# EAGLE design us8 (EAGLE 6.6.0)
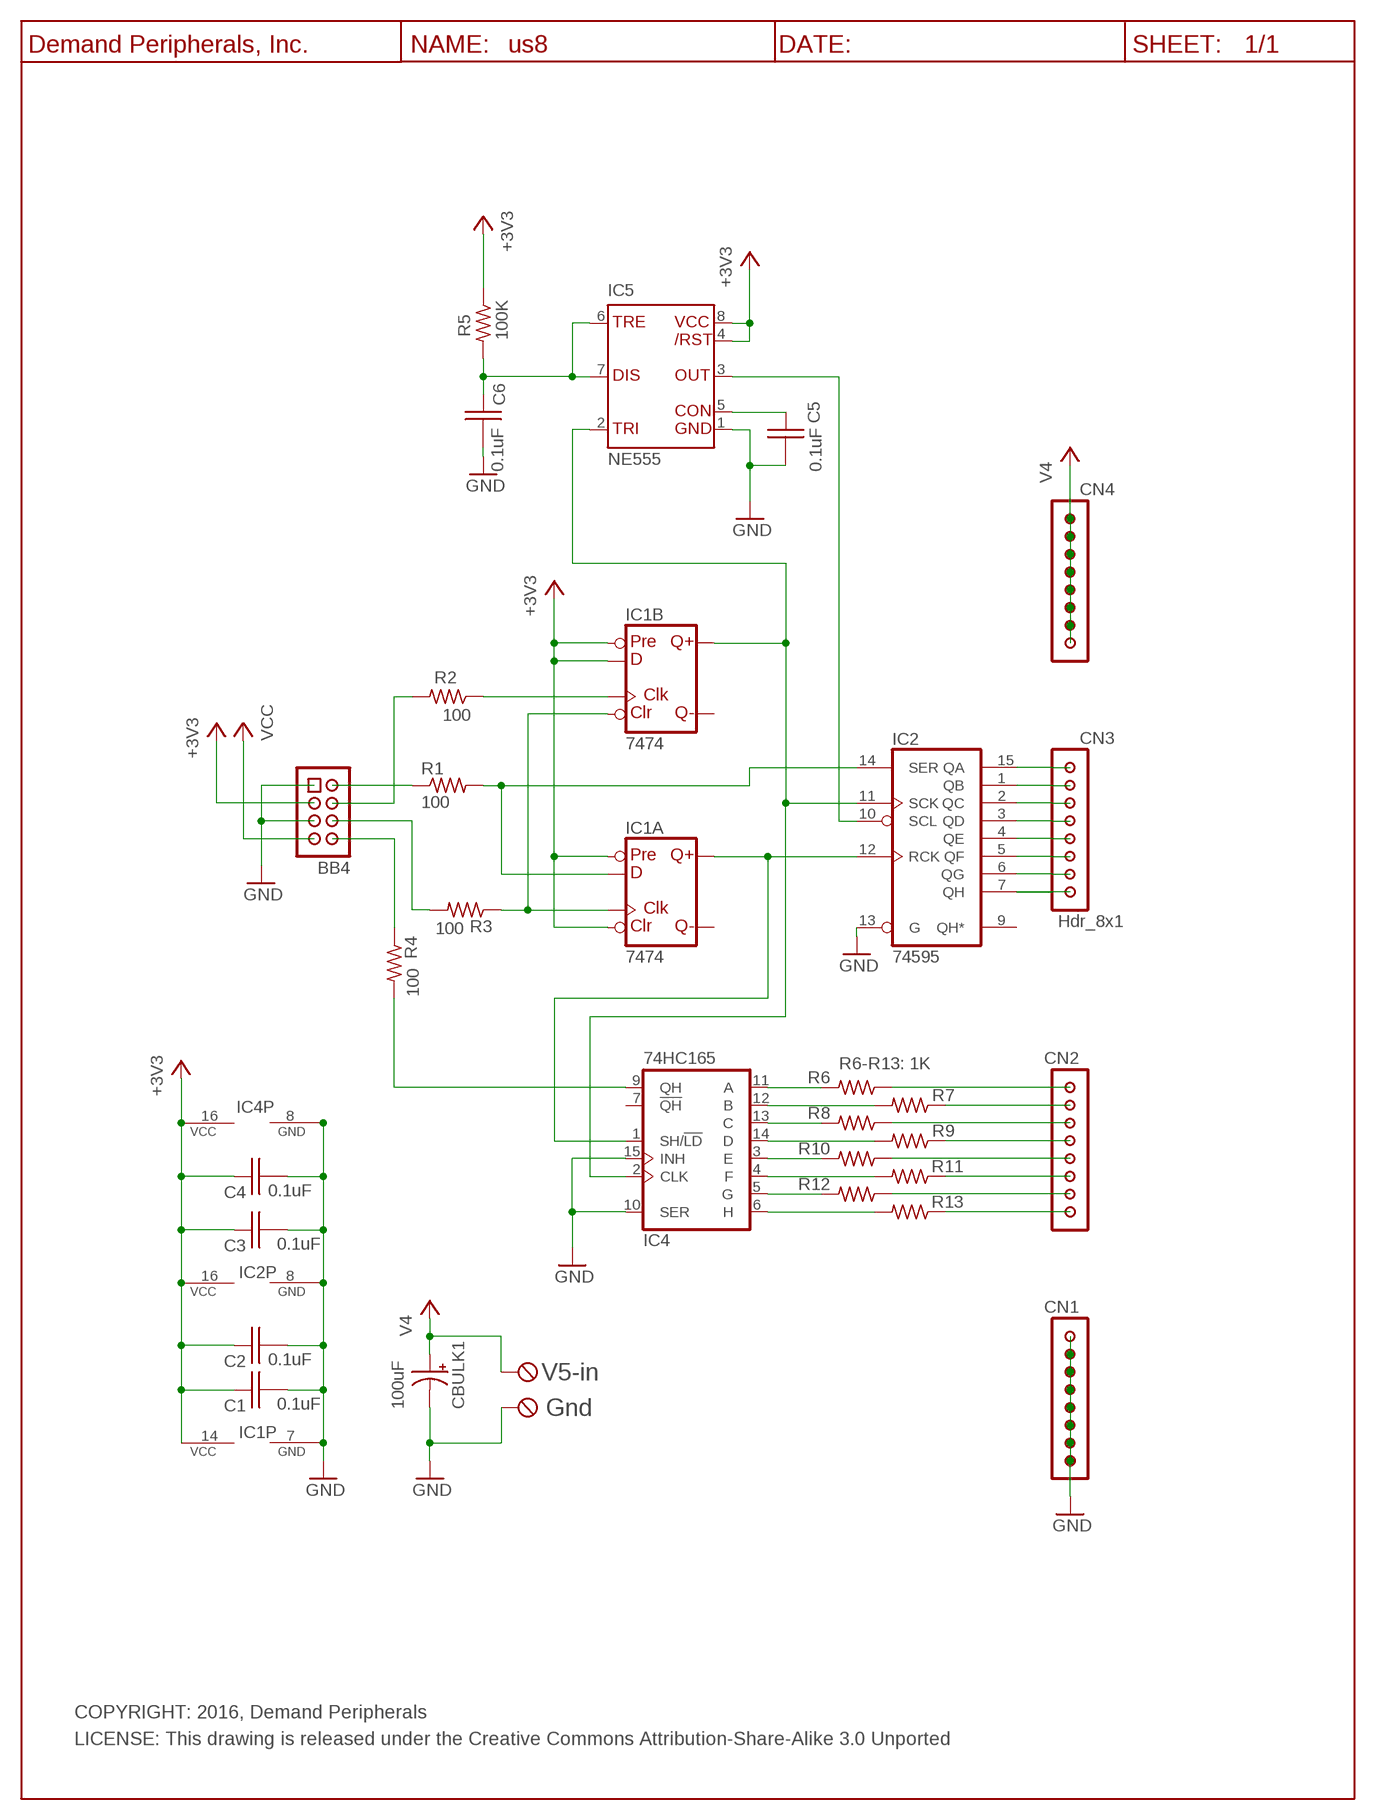
[diagram p0: schematic, sheet 1]

## Parts
BB4  Hdr_4x2  HDR-4X2-SHR  [HDR-4X2]
C1  0.1uF  C0.1UF_C0603  [C0603]
C2  0.1uF  C0.1UF_C0603  [C0603]
C3  0.1uF  C0.1UF_C0603  [C0603]
C4  0.1uF  C0.1UF_C0603  [C0603]
C5  0.1uF  C0.1UF_C0603  [C0603]
C6  0.1uF  C0.1UF_C0603  [C0603]
CBULK1  100uF  C100UF_E3.5-8  [E3.5-8]
CN1  Hdr_8x1  HDR-8X1-NOP1  [HDR-8X1-NOP1]
CN2  Hdr_8x1  HDR-8X1-NOP1  [HDR-8X1-NOP1]
CN3  Hdr_8x1  HDR-8X1-NOP1  [HDR-8X1-NOP1]
CN4  Hdr_8x1  HDR-8X1-NOP1  [HDR-8X1-NOP1]
CN5  TBLK-5.08-X2  [TBLK-5.08-X2]
IC1  7474  74AHC74SS  [SO14]
IC2  74595  [SO16]
IC4  74HC165  [SO16]
IC5  NE555  [SOIC8]
R1  100  R100_R0603  [R0603]
R2  100  R100_R0603  [R0603]
R3  100  R100_R0603  [R0603]
R4  100  R100_R0603  [R0603]
R5  100K  R100K_R0603  [R0603]
R6  1K  R1K_R0603  [R0603]
R7  1K  R1K_R0603  [R0603]
R8  1K  R1K_R0603  [R0603]
R9  1K  R1K_R0603  [R0603]
R10  1K  R1K_R0603  [R0603]
R11  1K  R1K_R0603  [R0603]
R12  1K  R1K_R0603  [R0603]
R13  1K  R1K_R0603  [R0603]
U$4  DP_FRAME_P  [P_FRAME]

## Nets
+3V3: BB4.3 C1.1 C2.1 C3.1 C4.1 IC1.1(A:CLR) IC1.4(A:PRE) IC1.10(B:PRE) IC1.12(B:D) IC1.14(P:VCC) IC2.16(VCC) IC4.16(VCC) IC5.4(/RES) IC5.8(VCC+) R5.1
GND: BB4.1 BB4.5 C1.2 C2.2 C3.2 C4.2 C5.2 C6.2 CBULK1.- CN1.1 CN1.2 CN1.3 CN1.4 CN1.5 CN1.6 CN1.7 CN1.8 CN5.1(KL) IC1.7(P:GND) IC2.8(GND) IC2.13(G) IC4.8(GND) IC4.10(SER) IC4.15(INH) IC5.1(GND)
N$1: BB4.2 R1.1
N$2: BB4.8 R4.1
N$3: CN2.1 R13.1
N$4: CN2.2 R12.1
N$5: CN2.3 R11.1
N$6: IC1.2(A:D) IC2.14(SER) R1.2
N$7: CN2.4 R10.1
N$8: CN2.5 R9.1
N$9: CN2.6 R8.1
N$10: CN2.7 R7.1
N$11: CN2.8 R6.1
N$12: IC4.11(A) R6.2
N$13: IC4.13(C) R8.2
N$14: CN3.1 IC2.7(QH)
N$15: IC1.3(A:CLK) IC1.13(B:CLR) R3.1
N$16: IC1.9(B:Q) IC2.11(SCK) IC4.2(CLK) IC5.2(TRI)
N$17: BB4.4 R2.2
N$18: IC1.11(B:CLK) R2.1
N$19: BB4.6 R3.2
N$20: IC4.9(QH) R4.2
N$21: CN3.2 IC2.6(QG)
N$22: CN3.3 IC2.5(QF)
N$23: CN3.4 IC2.4(QE)
N$24: CN3.5 IC2.3(QD)
N$25: CN3.6 IC2.2(QC)
N$26: CN3.7 IC2.1(QB)
N$27: CN3.8 IC2.15(QA)
N$28: IC4.3(E) R10.2
N$29: IC4.5(G) R12.2
N$30: IC4.12(B) R7.2
N$31: IC4.14(D) R9.2
N$32: IC4.4(F) R11.2
N$33: IC4.6(H) R13.2
N$34: IC1.5(A:Q) IC2.12(RCK) IC4.1(SH/!LD)
N$36: IC2.10(SCL) IC5.3(OUT)
N$37: C6.1 IC5.6(TRE) IC5.7(DIS) R5.2
N$40: C5.1 IC5.5(CON)
V4: CBULK1.+ CN4.1 CN4.2 CN4.3 CN4.4 CN4.5 CN4.6 CN4.7 CN4.8 CN5.2(KL1)
VCC: BB4.7
Unconnected: IC1.6(A:!Q) IC1.8(B:!Q) IC2.9(QH*) IC4.7(!QH)

## Notes on the sheet
- R6-R13: 1K
- V5-in
- Gnd
- COPYRIGHT: 2016, Demand Peripherals
- LICENSE: This drawing is released under the Creative Commons Attribution-Share-Alike 3.0 Unported

## Library data of the parts
BB4 = dpi-conn:HDR-4X2-SHR: Shrouded 4x2 pin header; VENDOR: Digikey; VENDOR-PART-NUM: 609-3530-ND
C1-C6 = dpi-passive:C0.1UF_: 0.1 uF Capacitor, 25V, X7R; VENDOR: Digikey; VENDOR-PART-NUM: 1276-1126-2-ND
CBULK1 = dpi-passive:C100UF_: 100uF polarized capacitor, general purpose; VENDOR: Digikey; VENDOR-PART-NUM: 1572-1044-ND
CN1-CN4 = dpi-conn:HDR-8X1-NOP1: Header, 8x1 with no Pin1 marker; VENDOR: Digikey; VENDOR-PART-NUM: S1012EC-08-ND
CN5 = dpi-conn:TBLK-5.08-X2: Terminal Block, 5.08mm, x2, screw terminals; VENDOR: Digikey; VENDOR-PART-NUM: ED2609-ND
IC1 = dpi-transic:74AHC74: Dual D type positive edge triggered FLIP FLOP, preset and clear; VENDOR: Digikey; VENDOR-PART-NUM: 568-4458-1-ND
IC2 = dpi-transic:74*595: 8-bit SHIFT REGISTER, output latch; VENDOR: Digikey; VENDOR-PART-NUM: 74HC595D(BJ)CT-ND
IC4 = dpi-transic:74HC165: NXP 74HC165 parallel-to-serial shift register; VENDOR: Digikey; VENDOR-PART-NUM: 568-1409-1-ND
IC5 = dpi-transic:NE555: Generic 555 Timer; VENDOR: Digikey; VENDOR-PART-NUM: 296-6502-1-ND
R1-R4 = dpi-passive:R100_: 100 Ohm resistor, 1%, 0.1 watt; VENDOR: Digikey; VENDOR-PART-NUM: 311-100HRTR-ND
R5 = dpi-passive:R100K_: 100K Resistor, 1%, 0.1 watt; VENDOR: Digikey; VENDOR-PART-NUM: 311-100KHRTR-ND
R6-R13 = dpi-passive:R1K_: 1K Resistor, 1%, 0.1 watt; VENDOR: Digikey; VENDOR-PART-NUM: 311-1.00KHRTR-ND
U$4 = dpi-sym:DP_FRAME_P: Portrait/Letter Document Frame

## Board
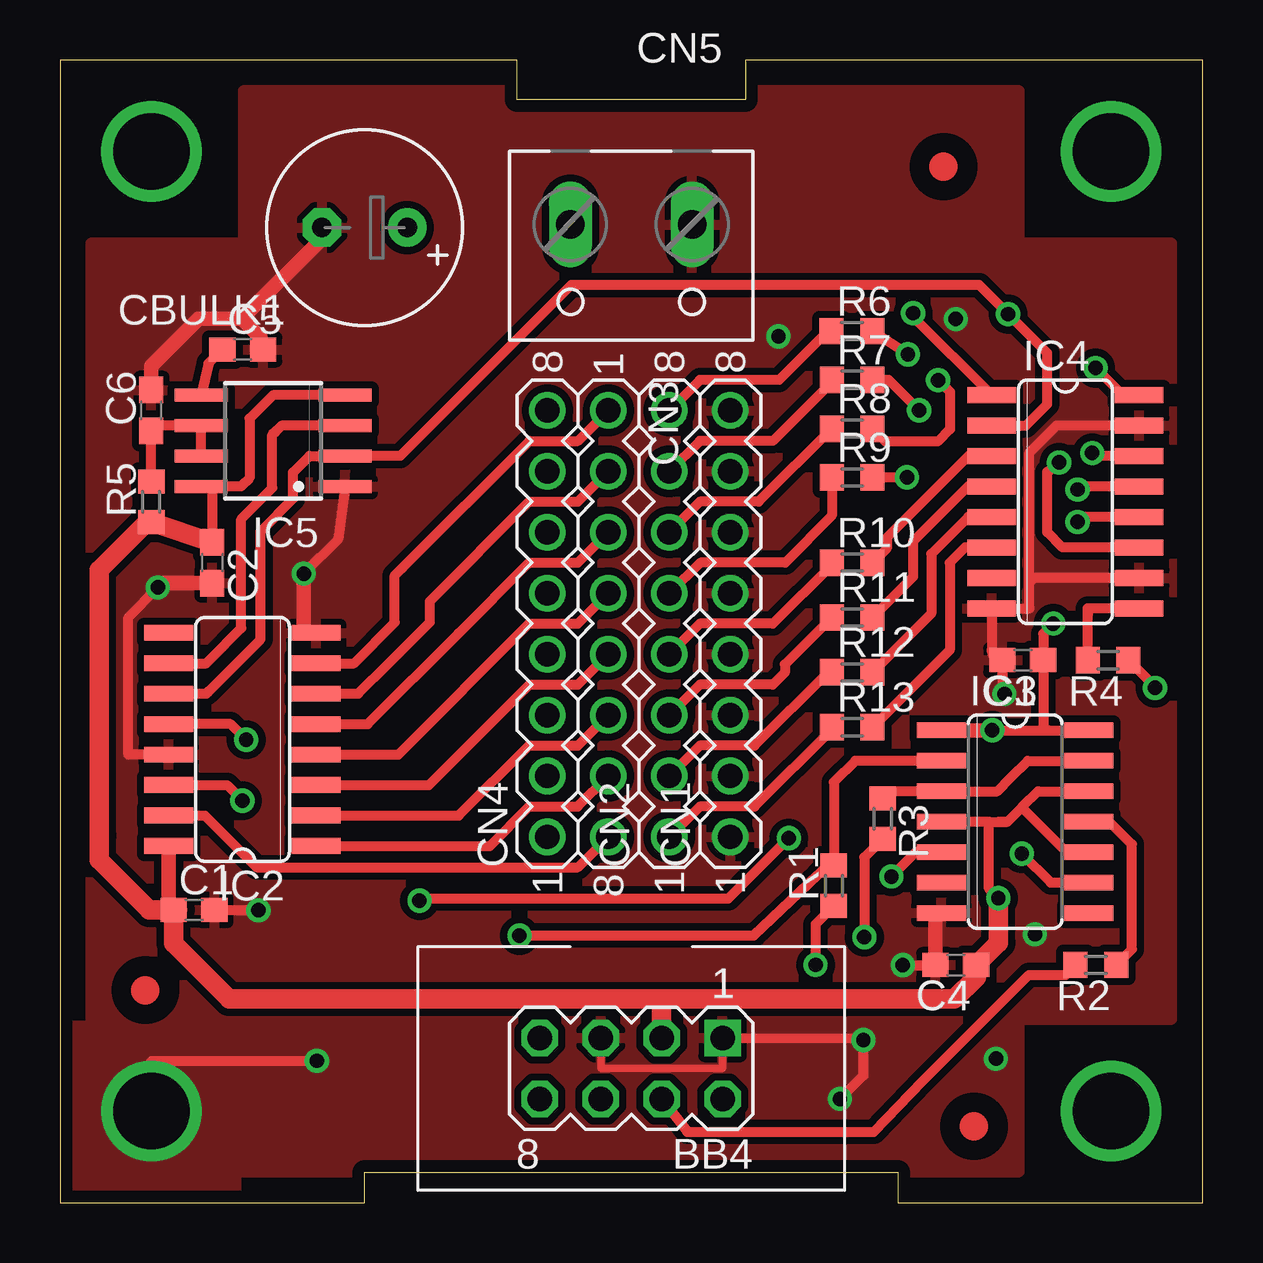
[diagram p1: board, top side]
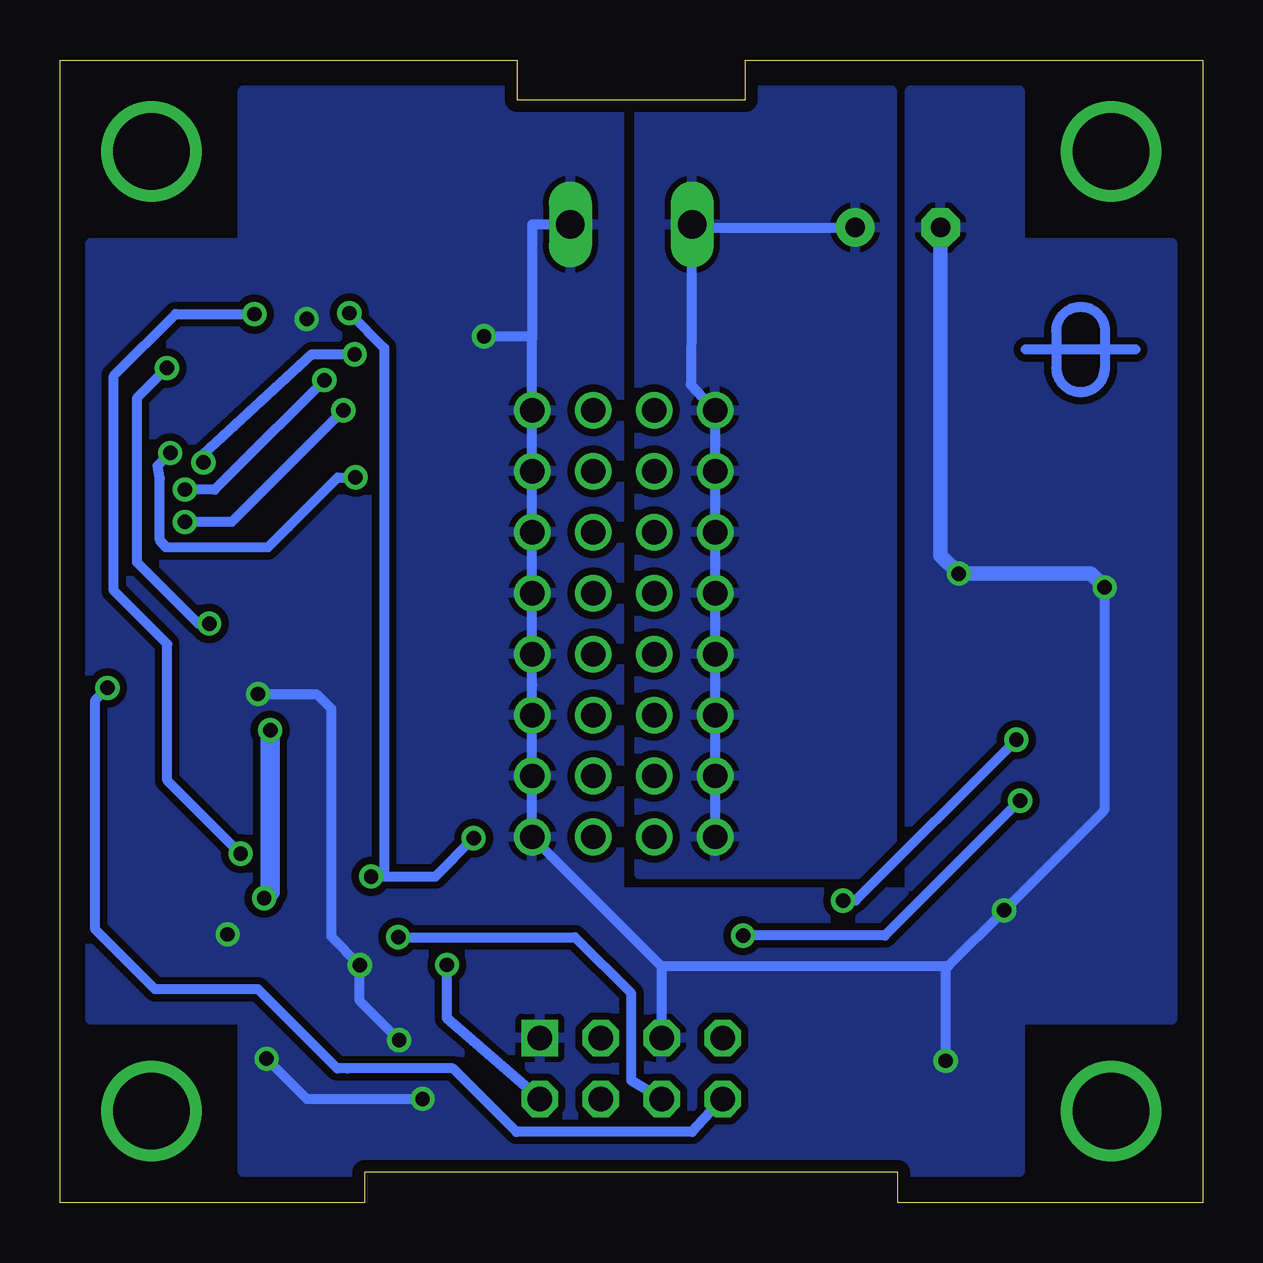
[diagram p2: board, bottom side, seen from below]

Size 47.62 x 47.62 mm. Coordinates in mm from the lower left corner, seen from the top.
Outline: 0,0 12.7,0 12.7,1.27 34.92,1.27 34.92,0 47.62,0 47.62,47.62 28.57,47.62 28.57,45.97 19.05,45.97 19.05,47.62 0,47.62 0,0
Copper layers (1*16): Top 0.035mm / dielectric 1.5mm / Bottom 0.035mm
Design rules "default *": minimum track width 10mil, minimum drill 20mil, track to track 12mil, track to pad 12mil, pad to pad 12mil, via to via 12mil, smd to smd 12mil, copper to edge 20mil, drill to drill 12mil, minimum pad ring 10mil, minimum via ring 8mil, stop-mask expansion 4mil, vias tented up to drill 0mil, thermal gap 10mil
tKeepout: area 15.1,1 to 32.5,9.7; area 15.1,0.5 to 32.5,9.7

### Footprints (pad centres in the part's own frame; a part is rotated, then mirrored left to right if it is on the bottom)
HDR-4X2 = drill 1.016 square: 1 -3.81,-1.27 | drill 1.016 octagon: 2 -3.81,1.27; 3 -1.27,-1.27; 4 -1.27,1.27; 5 1.27,-1.27; 6 1.27,1.27; 7 3.81,-1.27; 8 3.81,1.27
C0603 = smd 1.1 x 1: 1 -0.85,0; 2 0.85,0
E3.5-8 = drill 0.813 pad 1.6: + -1.778,0 | drill 0.813 pad 1.6 octagon: - 1.778,0
HDR-8X1-NOP1 = drill 1.016: 1 -8.89,0; 2 -6.35,0; 3 -3.81,0; 4 -1.27,0; 5 1.27,0; 6 3.81,0; 7 6.35,0; 8 8.89,0
TBLK-5.08-X2 = drill 1.194 long: 1 -2.54,-0.127; 2 2.54,-0.127
SO14 = smd 0.66 x 2.032: 1 -3.81,-3.073; 2 -2.54,-3.073; 3 -1.27,-3.073; 4 0,-3.073; 5 1.27,-3.073; 6 2.54,-3.073; 7 3.81,-3.073; 8 3.81,3.073; 9 2.54,3.073; 10 1.27,3.073; 11 0,3.073; 12 -1.27,3.073; 13 -2.54,3.073; 14 -3.81,3.073
SO16 = smd 0.66 x 2.032: 1 -4.445,-3.073; 2 -3.175,-3.073; 3 -1.905,-3.073; 4 -0.635,-3.073; 5 0.635,-3.073; 6 1.905,-3.073; 7 3.175,-3.073; 8 4.445,-3.073; 9 4.445,3.073; 10 3.175,3.073; 11 1.905,3.073; 12 0.635,3.073; 13 -0.635,3.073; 14 -1.905,3.073; 15 -3.175,3.073; 16 -4.445,3.073
SOIC8 = smd 2.2 x 0.55: 1 -3,1.905; 2 -3,0.635; 3 -3,-0.635; 4 -3,-1.905; 5 3,-1.905; 6 3,-0.635; 7 3,0.635; 8 3,1.905
R0603 = smd 1 x 1.1: 1 -0.85,0; 2 0.85,0

### Placement (x,y rotation side)
BB4  23.81,5.59 180 top
C1  5.59,12.19 0 top
C2  6.35,26.67 270 top
C3  40.13,22.61 180 top
C4  37.34,9.91 180 top
C5  7.62,35.56 0 top
C6  3.81,33.02 90 top
CBULK1  12.7,40.64 180 top
CN1  27.94,24.13 90 top
CN2  25.4,24.13 90 top
CN3  22.86,24.13 270 top
CN4  20.32,24.13 90 top
CN5  23.81,40.64 180 top
IC1  39.81,15.88 270 top
IC2  7.61,19.3 90 top
IC4  41.91,29.21 270 top
IC5  8.89,31.75 180 top
R1  32.26,13.21 90 top
R2  43.18,9.91 180 top
R3  34.29,16 270 top
R4  43.69,22.61 180 top
R5  3.81,29.21 90 top
R6  33.01,36.32 0 top
R7  33.02,34.29 0 top
R8  33.02,32.26 0 top
R9  33.02,30.23 0 top
R10  33.02,26.67 0 top
R11  33.02,24.38 0 top
R12  33.02,22.1 0 top
R13  33.02,19.81 0 top
U$1  [FIDUCIAL]  3.56,8.85 0 top
U$2  [FIDUCIAL]  38.1,3.17 0 top
U$3  [FIDUCIAL]  36.83,43.18 0 top
U$4  -2.54,-2.54 0 top
U$6  [DPI-1]  5.08,35.56 270 bottom

### Tracks (layer width: path | path; a pad name or v marks a point on that pad's centre or on a via)
+3V3  (via drill 0.6)
  Top 0.406: 38.72,15.88 IC1.4 | 38.72,15.88 39.5,15.88 | 39.5,15.88 40.09,16.47 | 40.09,16.47 40.15,16.52 40.77,17.14 IC1.12 | IC1.10 41.95,14.61 40.09,16.47 | 39.5,15.88 39.12,15.88 | v39.12,12.69 38.72,13.08 38.72,15.88 | C2.1 6.35,29.84 IC5.8 7.54,29.84 7.58,29.88 7.9,30.2 7.9,32.68 8.88,33.66 IC5.4 | v38.86,19.68 41.2,19.68 | 41.2,19.68 IC1.14 | 41.2,19.68 40.98,19.68 C3.1 40.98,23.71 v41.4,24.13 | IC4.16 44.3,33.66 v43.17,34.78
  Top 0.61: v38.86,19.68 IC1.1 | C2.1 6.29,27.58 | 5,12.19 C1.1 4.53,12.4 IC2.16
  Top 0.813: v39.12,12.69 39.12,10.83 C4.1 38.19,9.38 37.29,8.48 36.91,8.48 25.02,8.48 | C2.1 R5.1 3.63,28.36 1.64,26.36 1.64,15.29 1.64,14.28 3.72,12.19 C1.1 | C1.1 4.74,10.81 7.06,8.48 25.02,8.48 | C1.1 | BB4.3 25.08,8.42 25.02,8.48
  Bottom 0.406: v43.17,34.78 44.42,33.53 44.42,26.7 41.86,24.13 v41.4,24.13
  Bottom 0.813: v38.86,19.68 38.86,12.94 v39.12,12.69
GND  (via drill 0.6, 3.17 pad 3.17)
  Top 0.305: BB4.5 22.54,5.59 23.81,5.59 27.62,5.59 BB4.1
  Top 0.406: C1.2 8.26,12.19 v8.27,12.18 | 36.49,11.81 36.49,9.89 v35.13,9.89 | BB4.1 33.17,6.84 v33.49,6.77 33.49,5.3 v32.51,4.32 | v10.71,5.91 3.81,5.91 v3.81,3.81 | IC5.1 11.59,27.64 v10.16,26.21 | IC2.13 2.85,18.67 2.85,24.38 v4.08,25.64 | v39.37,21.2 39.28,21.28 C3.2 arc-90 38.84,23.05 IC4.8 40.41,24.77 40.41,25.86 | IC4.15 41.53,32.38 40.41,31.27 40.41,25.86 | IC4.10 40.59,26.04 40.41,25.86
  Top 0.61: 36.99,12.06 IC1.7 36.49,11.81 C4.2 | IC2.8 10.16,23.75 v10.16,26.21 | v4.08,25.64 4.25,25.82 C2.2 | C6.2 3.81,34.86 5.79,36.84 7.58,36.84 | 7.58,36.84 8.34,36.08 8.34,35.69 C5.2 | CBULK1.- 10.92,40.18 7.58,36.84
  Bottom 0.406: 27.94,21.59 CN1.3 CN1.2 CN1.1 22.54,9.84 | 27.94,21.59 CN1.4 CN1.5 CN1.6 CN1.7 CN1.8 27.94,36.03 | 22.54,9.84 BB4.5 | 27.94,21.59 27.95,21.6 | v4.08,25.64 4.08,16.37 v8.27,12.18 10.6,9.84 | 10.6,9.84 22.54,9.84 | v33.49,6.77 35.13,8.41 v35.13,9.89 36.32,11.09 36.32,20.59 36.93,21.2 v39.37,21.2 | v39.01,5.99 37.34,4.32 v32.51,4.32 | v29.95,36.11 28.02,36.11 27.94,36.03 | CN5.1 27.94,40.77 27.94,36.03 | v10.71,5.91 10.71,9.74 10.6,9.84
  Bottom 0.61: v4.08,25.64 4.65,26.21 v10.16,26.21 10.92,26.98 CBULK1.-
  other vias: 40.64,11.18 37.34,36.83
  pour Top: 40.01,1.27 40.01,7.62 46.35,7.62 46.35,40.01 40.01,40.01 40.01,46.35 7.62,46.35 7.62,40.01 1.27,40.01 1.27,7.37 0.51,7.37 0.51,0.51 7.37,0.51 7.37,1.27
  pour Bottom: 40.01,1.27 40.01,7.62 46.35,7.62 46.35,40.01 40.01,40.01 40.01,46.35 24.33,46.35 24.33,12.95 12.19,12.95 12.19,46.35 7.62,46.35 7.62,40.01 1.27,40.01 1.27,7.62 7.62,7.62 7.62,1.27
MOUNT  (via drill 3.17 pad 3.17)
  other vias: 43.81,43.81
N$1  (via drill 0.6)
  Top 0.406: R1.1 31.5,11.6 v31.5,9.91
  Bottom 0.406: BB4.2 31.5,7.68 v31.5,9.91
N$2  (via drill 0.6)
  Top 0.406: v45.64,21.45 45.64,21.5 R4.1
  Bottom 0.406: BB4.8 21.27,2.95 28.6,2.95 31.24,5.59 35.65,5.59 36.07,5.59 39.37,8.89 41.57,8.89 43.66,8.89 46.15,11.38 46.15,20.94 v45.64,21.45
N$3
  Top 0.406: R13.1 32.17,19.72 28.96,16.51 26.67,16.51 CN2.1
N$4
  Top 0.406: R12.1 32,22.1 28.96,19.05 26.67,19.05 CN2.2
N$5
  Top 0.406: R11.1 30.21,22.43 30.21,22.09 29.72,21.59 27.18,21.59 26.67,21.59 CN2.3
N$6  (via drill 0.6)
  Top 0.406: IC2.14 6.96,17.4 v7.61,16.75 | v19.15,11.12 27.55,11.12 28.92,11.12 31.59,13.65 31.99,14.06 R1.2 32.26,17.53 33.15,18.41 IC1.2
  Bottom 0.406: v7.61,16.75 13.23,11.12 v19.15,11.12
N$7
  Top 0.406: R10.1 32.17,26.58 29.72,24.13 26.67,24.13 CN2.4
N$8
  Top 0.406: R9.1 32.17,28.64 30.24,26.67 26.71,26.67 CN2.5
N$9
  Top 0.406: R8.1 29.12,29.21 27.18,29.21 26.67,29.21 CN2.6
N$10
  Top 0.406: R7.1 32.17,34.2 29.72,31.75 26.67,31.75 CN2.7
N$11
  Top 0.406: R6.1 32,36.32 29.97,34.29 26.67,34.29 CN2.8
N$12  (via drill 0.6)
  Top 0.406: IC4.11 41.78,27.3 41.15,27.94 41.15,30.45 v41.64,30.85 | v35.34,35.36 R6.2
  Bottom 0.406: v35.34,35.36 37.12,35.36 41.64,31.19 v41.64,30.85
N$13  (via drill 0.6)
  Top 0.406: v36.6,34.28 37.1,33.8 37.1,32.23 36.59,31.73 35.33,31.73 34.4,31.73 R8.2 | IC4.13 42.55,29.84 v42.42,29.72
  Bottom 0.406: v36.6,34.28 40.46,30.43 41.17,29.72 v42.42,29.72
N$14
  Top 0.406: CN3.1 21.59,31.75 19.57,31.75 14.26,26.44 13.96,26.14 13.96,24.18 12.26,22.48 IC2.7
N$15
  Top 0.406: IC1.13 40.34,18.41 39.65,17.73 39.06,17.14 IC1.3 34.58,17.14 R3.1
N$16  (via drill 0.6)
  Top 0.406: IC1.9 41.3,13.34 v40.09,14.54 | IC2.11 6.1,21.21 6.2,21.31 8.36,23.47 8.36,27.98 9.72,29.34 9.72,30.43 10.4,31.11 IC5.2 14.19,31.11 21.31,38.24 38.32,38.24 v39.52,37.03 41.15,35.41 41.15,33.27 40.26,32.38 IC4.2
  Bottom 0.406: v40.09,14.54 43.16,17.6 43.16,23.28 45.38,25.5 45.38,34.47 42.81,37.03 v39.52,37.03
N$17
  Top 0.406: R2.2 41.91,9.49 40.39,9.49 35.98,5.08 33.92,2.95 29.62,2.95 26.15,2.95 BB4.4
N$18
  Top 0.406: R2.1 44.68,10.55 44.68,14.94 43.74,15.88 IC1.11
N$19  (via drill 0.6)
  Top 0.406: R3.2 33.53,14.39 v33.53,11.06
  Bottom 0.406: BB4.6 23.81,5.08 23.81,8.71 26.16,11.06 v33.53,11.06
N$20
  Top 0.406: R4.2 42.84,24.46 | 42.84,24.46 42.84,24.77 | IC4.9 42.84,24.77 | 42.84,24.77 42.84,24.46
N$21
  Top 0.406: IC2.6 12.43,21.21 13.7,22.48 15.42,24.19 15.42,25.07 19.56,29.21 21.59,29.21 CN3.2
N$22
  Top 0.406: CN3.3 21.59,26.67 19.56,26.67 16.61,23.72 12.83,19.94 IC2.5
N$23
  Top 0.406: IC2.4 14.11,18.67 14.11,18.68 19.56,24.13 21.59,24.13 CN3.4
N$24
  Top 0.406: CN3.5 21.59,21.59 19.57,21.59 15.38,17.4 IC2.3
N$25
  Top 0.406: CN3.6 21.59,19.05 19.55,19.05 16.62,16.13 IC2.2
N$26
  Top 0.406: CN3.7 21.58,16.51 19.56,16.51 17.92,14.86 IC2.1
N$27
  Top 0.406: CN3.8 21.59,13.97 19.56,13.97 8.19,13.97 6.21,15.95 6.03,16.13 IC2.15
N$28
  Top 0.406: IC4.3 37.87,31.11 34.47,27.71 34.47,27.27 R10.2
N$29
  Top 0.406: IC4.5 37.86,28.57 36.32,27.04 36.32,24.55 R12.2
N$30  (via drill 0.6)
  Top 0.406: v35.81,33.02 34.54,34.29 R7.2 | IC4.12 42.62,28.57 v42.42,28.37
  Bottom 0.406: v35.81,33.02 39.62,29.21 40.46,28.37 v42.42,28.37
N$31  (via drill 0.6)
  Top 0.406: v35.31,30.23 R9.2 | IC4.14 43.16,31.11 v43.03,31.24
  Bottom 0.406: v35.31,30.23 36.04,30.23 38.11,28.16 38.96,27.3 43.2,27.3 43.46,27.62 43.46,30.19 43.56,30.71 v43.03,31.24
N$32
  Top 0.406: IC4.4 37.85,29.84 35.56,27.56 35.56,26.07 R11.2
N$33
  Top 0.406: IC4.6 37.72,27.3 37.08,26.67 37.08,23.03 R13.2
N$34  (via drill 0.6)
  Top 0.406: v14.99,12.59 15.07,12.68 27.86,12.68 v30.38,15.19 | v7.76,19.29 7.11,19.94 IC2.12 | IC1.5 35.67,14.61 v34.66,13.59 | IC4.1 35.56,36.93 v35.56,37.07
  Bottom 0.406: v14.99,12.59 14.46,12.59 v7.76,19.29 | 34.11,13.59 v34.66,13.59 | v35.56,37.07 34.11,35.62 34.11,13.59 | 34.11,13.59 31.98,13.59 v30.38,15.19
N$36
  Top 0.406: 9,32.16 8.85,32 8.85,29.78 7.56,28.49 7.56,23.94 6.26,22.64 6.1,22.48 IC2.10 | 9,32.16 9.23,32.38 | IC5.3 9.23,32.38 | 9.23,32.38 9,32.16
N$37
  Top 0.406: R5.2 C6.1 4.03,32.38 IC5.6 IC5.7
N$40
  Top 0.406: C5.1 6.29,35.08 6.19,34.98 IC5.5
N$41  (via drill 3.17 pad 3.17)
  other vias: 3.81,43.81
N$43  (via drill 3.17 pad 3.17)
  other vias: 43.81,3.81
V4
  Bottom 0.406: CBULK1.+ 21.21,40.64 CN5.2 21.32,34.1 CN4.8 CN4.7 CN4.6 CN4.5 CN4.4 CN4.3 CN4.2 CN4.1
  pour Bottom: 23.47,46.35 12.95,46.35 12.95,13.69 23.47,13.69

### Text on the board
tTest: 1.875 Inches | 1.575 Inches | 5V | Gnd | (C) 2017, Demand Peripherals, Inc. | + | US8, Rev 17A | CBULK | R6 | C5 | 5V | O | I | G | C6 | IC3 | R7 | 1 | 1 | 2 | 2 | R8 | R9 | R5 | IC4 | 3 | 3 | C2 | 4 | 4 | R10 | R11 | 5 | 5 | R4 | R12 | 6 | 6 | C3 | 7 | 7 | R13 | IC1 | 8 | 8 | R3 | 1.575 Inches | 1.875 Inches | IC2 | 5V | O | I | G | R1 | C1 | R2 | C4 | BB4